# EAGLE design sapflow_v5 (EAGLE 9.6.0)
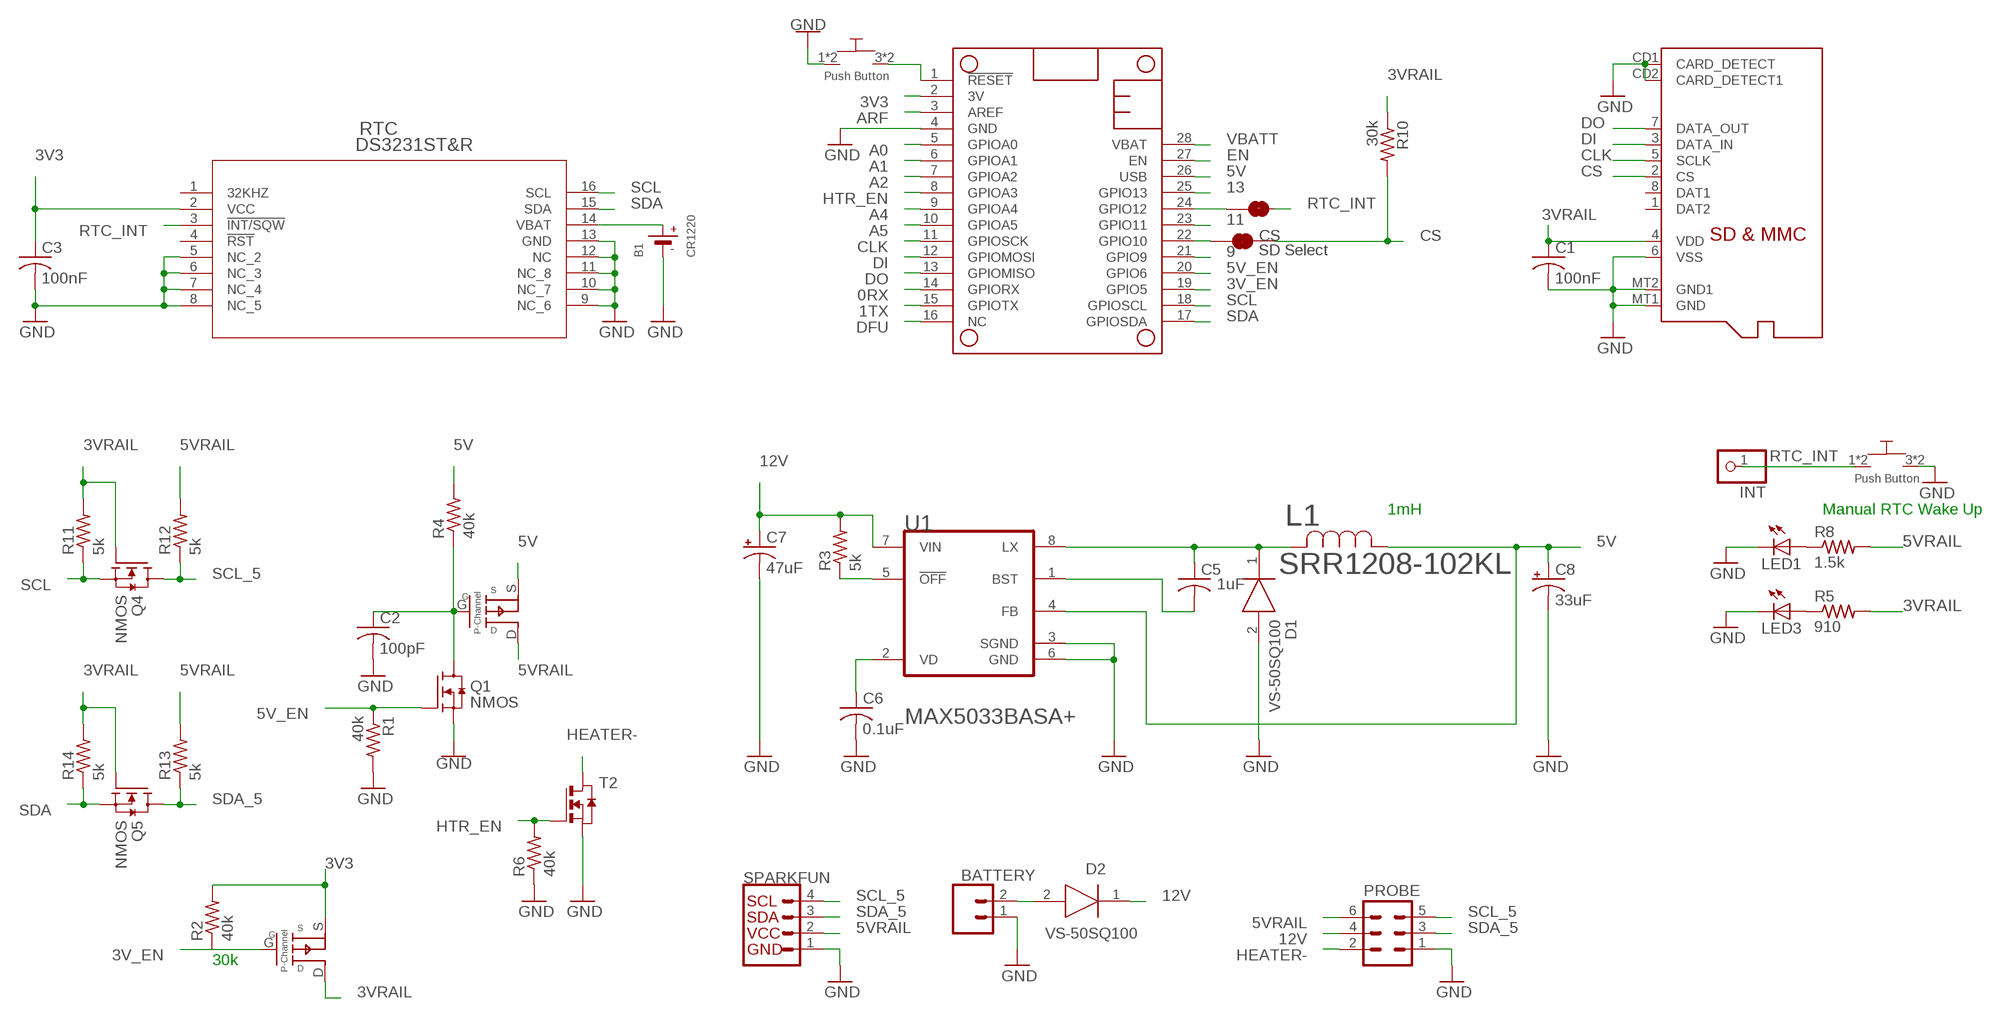
[diagram p0: schematic, sheet 1]

## Parts
B1  CR1220  BATTERYCR1220_SMT  [CR1220]
BATTERY  HIGHV-OUT  CONN_021X02_NO_SILK  [1X02_NO_SILK]
C1  100nF  C-USC0805  [C0805]
C2  100pF  C-USC0805  [C0805]
C3  100nF  C-USC0805  [C0805]
C5  1uF  C-USC0805  [C0805]
C6  0.1uF  C-USC0805  [C0805]
C7  47uF  CPOL-USD/7343-31R  [D/7343-31R]
C8  33uF  CPOL-USD/7343-31R  [D/7343-31R]
CS  SD Select  JUMPER-SMT_2_NC_TRACE_SILK  [SMT-JUMPER_2_NC_TRACE_SILK]
D1  VS-50SQ100  [DIOAD1405W86L465D235]
D2  VS-50SQ100  [DIOAD1405W86L465D235]
INT  PINHD-1X1CB  [1X01-CLEANBIG]
L1  SRR1208-102KL  [IND_BOURNS_SRR1208]
LED1  RED  LEDCHIPLED_0805  [CHIPLED_0805]
LED3  RED  LEDCHIPLED_0805  [CHIPLED_0805]
MICROSD  MICROSD  [MICROSD]
MS2  FEATHERWING  [FEATHERWING]
PMOS1  SSM3J3228R  [SOT-23-3]
PMOS2  SSM3J3228R  [SOT-23-3]
PROBE  MA03-2  [MA03-2]
Q1  NMOS  [SOT23-S]
Q4  NMOS  [SOT23-S]
Q5  NMOS  [SOT23-S]
R1  40k  R-US_R0805  [R0805]
R2  40k  R-US_R0805  [R0805]
R3  5k  R-US_R0805  [R0805]
R4  40k  R-US_R0805  [R0805]
R5  910  R-US_R0805  [R0805]
R6  40k  R-US_R0805  [R0805]
R8  1.5k  R-US_R0805  [R0805]
R10  30k  R-US_R0805  [R0805]
R11  5k  R-US_R0805  [R0805]
R12  5k  R-US_R0805  [R0805]
R13  5k  R-US_R0805  [R0805]
R14  5k  R-US_R0805  [R0805]
RTC  DS3231ST&R  [21-0042B_16]
RTC_INT  JUMPER-SMT_2_NC_TRACE_SILK  [SMT-JUMPER_2_NC_TRACE_SILK]
SPARKFUN  I2C_STANDARD_NO_SILK  [1X04_NO_SILK]
T2  NMOSSOT223  [SOT223]
U1  MAXIM_MAX5033BASA+MAXIM_MAX5033BASA+_0_1  [MAXIM_MAX5033BASA+_1]
U$1  PUSH_BUTTON  [PUSHBUTTON_SMD]
U$2  PUSH_BUTTON  [PUSHBUTTON_SMD]

## Nets
0RX: MS2.14(GPIORX)
1TX: MS2.15(GPIOTX)
3V3: C3.1 MS2.2(3V) PMOS2.S R2.2 RTC.2(VCC)
3V_EN: MS2.19(GPIO5) PMOS2.G R2.1
3VRAIL: C1.1 MICROSD.4(VDD) PMOS2.D Q4.1(G) Q5.1(G) R5.2 R10.1 R11.2 R14.2
5V: C8.+ L1.1 MS2.26(USB) PMOS1.S R4.2 U1.4(FB)
5V_EN: MS2.20(GPIO6) Q1.1(G) R1.1
5VRAIL: PMOS1.D PROBE.6 R8.2 R12.2 R13.2 SPARKFUN.2(VCC)
9: MS2.21(GPIO9)
11: MS2.23(GPIO11)
12V: C7.+ D2.1(K) PROBE.4 R3.2 U1.7(VIN)
13: MS2.25(GPIO13)
A0: MS2.5(GPIOA0)
A1: MS2.6(GPIOA1)
A2: MS2.7(GPIOA2)
A4: MS2.9(GPIOA4)
A5: MS2.10(GPIOA5)
ARF: MS2.3(AREF)
CLK: MICROSD.5(SCLK) MS2.11(GPIOSCK)
CS: CS.2 MICROSD.2(CS) R10.2
DFU: MS2.16(NC)
DI: MICROSD.3(DATA_IN) MS2.12(GPIOMOSI)
DO: MICROSD.7(DATA_OUT) MS2.13(GPIOMISO)
EN: MS2.27(EN)
GND [GND]: B1.- BATTERY.1 C1.2 C2.2 C3.2 C6.2 C7.- C8.- D1.2(A) LED1.C LED3.C MICROSD.6(VSS) MICROSD.CD1(CARD_DETECT) MICROSD.CD2(CARD_DETECT1) MICROSD.MT1(GND) MICROSD.MT2(GND1) MS2.4(GND) PROBE.1 Q1.2(S) R1.2 R6.1 RTC.5(NC_2) RTC.6(NC_3) RTC.7(NC_4) RTC.8(NC_5) RTC.9(NC_6) RTC.10(NC_7) RTC.11(NC_8) RTC.12(NC) RTC.13(GND) SPARKFUN.1(GND) T2.3(S) U1.3(SGND) U1.6(GND) U$1.1 U$1.2 U$2.3 U$2.4
HEATER-: PROBE.2 T2.2(D) T2.4(D)
HTR_EN: MS2.8(GPIOA3) R6.2 T2.1(G)
N$1: MS2.1(!RESET) U$1.3 U$1.4
N$2: B1.+$1(+) RTC.14(VBAT)
N$4: BATTERY.2 D2.2(A)
N$5: LED3.A R5.1
N$6: C6.1 U1.2(VD)
N$9: R3.1 U1.5(!OFF!)
N$10: C2.1 PMOS1.G Q1.3(D) R4.1
N$11: CS.1 MS2.22(GPIO10)
N$12: LED1.A R8.1
N$14: MS2.24(GPIO12) RTC_INT.1
N$16: C5.2 U1.1(BST)
N$17: C5.1 D1.1(K) L1.2 U1.8(LX)
RTC_INT: INT.1 RTC.3(!INT/SQW) RTC_INT.2 U$2.1 U$2.2
SCL: MS2.18(GPIOSCL) Q4.2(S) R11.1 RTC.16(SCL)
SCL_5: PROBE.5 Q4.3(D) R12.1 SPARKFUN.4(SCL)
SDA: MS2.17(GPIOSDA) Q5.2(S) R14.1 RTC.15(SDA)
SDA_5: PROBE.3 Q5.3(D) R13.1 SPARKFUN.3(SDA)
VBATT: MS2.28(VBAT)
Unconnected: MICROSD.1(DAT2) MICROSD.8(DAT1) RTC.1(32KHZ) RTC.4(!RST)

## Notes on the sheet
- 1mH | Manual RTC Wake Up
- 30k

## Library data of the parts
B1 = microbuilder:BATTERY: CR1220 SMT - Digikey: 3001K-ND CD2032 BAT-HLD-001 - Digikey: BAT-HLD-001-ND
BATTERY = SparkFun-Connectors:CONN_02: Multi connection point. Often used as Generic Header-pin footprint for 0.1 inch spaced/style header connections On any of the 0.1 inch spaced packages, you can populate with these: Break Away Headers - Straight <https://www.sparkfun.com/products/116> (PRT-00116) Break Away Male Headers - Right Angle <https://www.sparkfun.com/products/553> (PRT-00553) Female Headers <https://www.sparkfun.com/products/115> (PRT-00115) Break Away Headers - Machine Pin <https://www.sparkfun.com/products/117> (PRT-00117) Break Away Female Headers - Swiss Machine Pin <https://www.sparkfun.com/products/743> (PRT-00743) For SCREWTERMINALS and SPRING TERMINALS visit here: Screw Terimnals on SparkFun.com <https://www.sparkfun.com/search/results?term=Screw+Terminals> (5mm/3.5mm/2.54mm spacing) This device is also useful as a general connection point to wire up your design to another part of your project. Our various solder wires solder well into these plated through hole pads. Hook-Up Wire - Assortment (Stranded, 22 AWG) <https://www.sparkfun.com/products/11375> (PRT-11375) Hook-Up Wire - Assortment (Solid Core, 22 AWG) <https://www.sparkfun.com/products/11367> (PRT-11367) View the entire wire category on our website here <https://www.sparkfun.com/categories/141> Special notes: Molex polarized connector foot print use with: PRT-08233 with associated crimp pins and housings. 2.54_SCREWTERM for use with PRT-10571. 3.5mm Screw Terminal footprints for PRT-08084 5mm Screw Terminal footprints for use with PRT-08432
C1 C3 = adafruit:C-US: CAPACITOR, American symbol
C2 = resistor:C-US: CAPACITOR, American symbol
C5 C6 = rcl:C-US: CAPACITOR, American symbol; SPICEPREFIX: C
C7 C8 = rcl:CPOL-US: POLARIZED CAPACITOR, American symbol; SPICEPREFIX: C
CS RTC_INT = SparkFun-Jumpers:JUMPER-SMT_2_NC_TRACE: Normally closed trace jumper This jumper has a trace between two pads so it's normally closed (NC). Use a razor knife to open the connection. For best results follow the IPC guidelines for cutting traces: Cutout at least 0.063 mm (0.005 in). Remove all loose material to clean up the cut area. Seal the cut with an approved epoxy. Reapply solder to reclose the connection.
D1 D2 = VS-50SQ100:VS-50SQ100: VS-50SQ100, Schottky Diode, 5A max, 100V, 2-Pin, DO-204AR Source: Datasheet <http://docs-emea.rs-online.com/webdocs/0791/0900766b8079106c.pdf>; ALLIED_NUMBER: 70078786; ALLIED_PRICE-STOCK: http://www.alliedelec.com/vishay-pcs-vs-50sq100/70078786/; DESCRIPTION: VS-50SQ100, Schottky Diode, 5A max, 100V, 2-Pin, DO-204AR; HEIGHT: mm; MANUFACTURER_NAME: Vishay; MANUFACTURER_PART_NUMBER: VS-50SQ100; MOUSER_PART_NUMBER: 844-50SQ100; MOUSER_PRICE-STOCK: https://www.mouser.com/Search/Refine.aspx?Keyword=844-50SQ100; RS_PART_NUMBER: 5446041; RS_PRICE-STOCK: https://uk.rs-online.com/web/p/products/5446041
INT = adafruit:PINHD-1X1: Pin header 1x1 for 0.1" spacing With round pins
L1 = SRR1208-102KL:SRR1208-102KL; BUILT_BY: EMA_UL_Team; MANUFACTURER_PART_NUMBER: SRR1208-102KL; VENDOR: Bourns Electronics
LED1 LED3 = adafruit:LED: LED OSRAM: - CHIPLED LG R971, LG N971, LY N971, LG Q971, LY Q971, LO R971, LY R971 LH N974, LH R974 LS Q976, LO Q976, LY Q976 LO Q996 - Hyper CHIPLED LW Q18S LB Q993, LB Q99A, LB R99A - SideLED LS A670, LO A670, LY A670, LG A670, LP A670 LB A673, LV A673, LT A673, LW A673 LH A674 LY A675 LS A676, LA A676, LO A676, LY A676, LW A676 LS A679, LY A679, LG A679 - Hyper Micro SIDELED® LS Y876, LA Y876, LO Y876, LY Y876 LT Y87S - SmartLED LW L88C, LW L88S LB L89C, LB L89S, LG L890 LS L89K, LO L89K, LY L89K LS L896, LA L896, LO L896, LY L896 - TOPLED LS T670, LO T670, LY T670, LG T670, LP T670 LSG T670, LSP T670, LSY T670, LOP T670, LYG T670 LG T671, LOG T671, LSG T671 LB T673, LV T673, LT T673, LW T673 LH T674 LS T676, LA T676, LO T676, LY T676, LB T676, LH T676, LSB T676, LW T676 LB T67C, LV T67C, LT T67C, LS T67K, LO T67K, LY T67K, LW E67C LS E67B, LA E67B, LO E67B, LY E67B, LB E67C, LV E67C, LT E67C LW T67C LS T679, LY T679, LG T679 LS T770, LO T770, LY T770, LG T770, LP T770 LB T773, LV T773, LT T773, LW T773 LH T774 LS E675, LA E675, LY E675, LS T675 LS T776, LA T776, LO T776, LY T776, LB T776 LHGB T686 LT T68C, LB T68C - Hyper Mini TOPLED® LB M676 - Mini TOPLED Santana® LG M470 LS M47K, LO M47K, LY M47K Source: http://www.osram.convergy.de/
MICROSD = adafruit_improved:MICROSD: Micro-SD / Transflash card holder with SPI pinout For the 3M # 2908-05WB-MG and/or 4UCON #19656 push-push type
MS2 = adafruit:FEATHERWING
PMOS1 PMOS2 = M0_Power:SSM3J3228R: P-Channel MOSFET, SOT-23-3 SMD Package
PROBE = better_header:MA03-2: PIN HEADER; OC_FARNELL: unknown; OC_NEWARK: unknown
Q1 Q4 Q5 = eDNA:NMOS
R1-R6 R8 R10-R14 = rcl:R-US_: RESISTOR, American symbol; SPICEPREFIX: R
RTC = power8:DS3231ST&R: DS3231 RTC IC only; MANUFACTURER_PART_NUMBER: DS3231S#T&R; VENDOR: Maxim Integrated Products
SPARKFUN = SparkX:I2C_STANDARD: SparkFun I2C Standard Pinout Header SparkFun has standardized on a pinout for all I2C based sensor breakouts. This pinout allows I2C boards to be plugged directly into the headers on Arduino Uno compatible boards, and to be daisy chained easily. Example SparkFun Products: SparkFun Atmospheric Sensor Breakout - BME280 <https://www.sparkfun.com/products/13676> SparkFun Altitude/Pressure Sensor Breakout - MPL3115A2 <https://www.sparkfun.com/products/11084> SparkFun TOF Range Finder Sensor - VL6180 <https://www.sparkfun.com/products/12785>
T2 = zetex:NMOSSOT223: MOS FET; OC_FARNELL: unknown; OC_NEWARK: unknown
U1 = Maxim - MAX5033BASA+:MAXIM_MAX5033BASA+: MAX-MAX5033-IL8; CIIVA_IDS: 1484514; CODE__IPC: SOIC127P600-8; CODE__JEDEC: MS-012-AA; COMPONENT_LINK_1_DESCRIPTION: Manufacturer URL; COMPONENT_LINK_1_URL: http://www.maxim-ic.com; COMPONENT_LINK_3_DESCRIPTION: Package Specification; COMPONENT_LINK_3_URL: http://pdfserv.maxim-ic.com/package_dwgs/21-0041.PDF; DATASHEET: http://datasheets.maxim-ic.com/en/ds/MAX5033.pdf; DATASHEET_VERSION: Rev 5, May-2011; FOOTPRINT_VARIANT_NAME_0: Level C; FOOTPRINT_VARIANT_NAME_1: Level B; FOOTPRINT_VARIANT_NAME_2: Level A; IMPORTED: yes; IMPORTED_FROM: vault; IMPORT_TS: 1521862065; MF: Maxim; MPN: MAX5033BASA+; PACKAGE: S8+5; PACKAGE_DESCRIPTION: 8-Pin Small-Outline IC, Narrow (0.15in), 1.27 mm Pitch, SOIC (N), Pb-Free; PACKAGE_VERSION: revC, 2010; PREFIX: U; RELEASE_DATE: 1332919945; VAULT_GUID: 1E7CABE1-80B5-44B1-A1B1-D79A0DB0D6E1; VAULT_REVISION: 223A1D72-BB07-4F7F-9695-43D469E578B1
U$1 U$2 = eDNA:PUSH_BUTTON: SMD low profile push-button NOPE https://www.mouser.com/ProductDetail/ALPS/SKTHAHE010?qs=sGAEpiMZZMsgGjVA3toVBFPD9IcV2kPoEtmOqlcDILk%3D https://www.digikey.com/product-detail/en/c-k/KMR731NG-LFS/CKN10687TR-ND/6035353 https://www.arrow.com/en/products/kmr731nglfs/ck https://www.mouser.com/ProductDetail/CK/KMR731NGLFS?qs=%2Fha2pyFaduiYmAh2YH01EjoHSsd%2F4x%252BsVgk0GVi4JwmLxfMBh2nzdw%3D%3D

## Net classes
0 default: clearance 0.205 mm
1 GND: clearance 0.205 mm to class 0, clearance 0.205 mm
2 HIGHVOLTAGE: clearance 0.205 mm to class 0, clearance 0.205 mm to class 1, clearance 0.3 mm

## Board
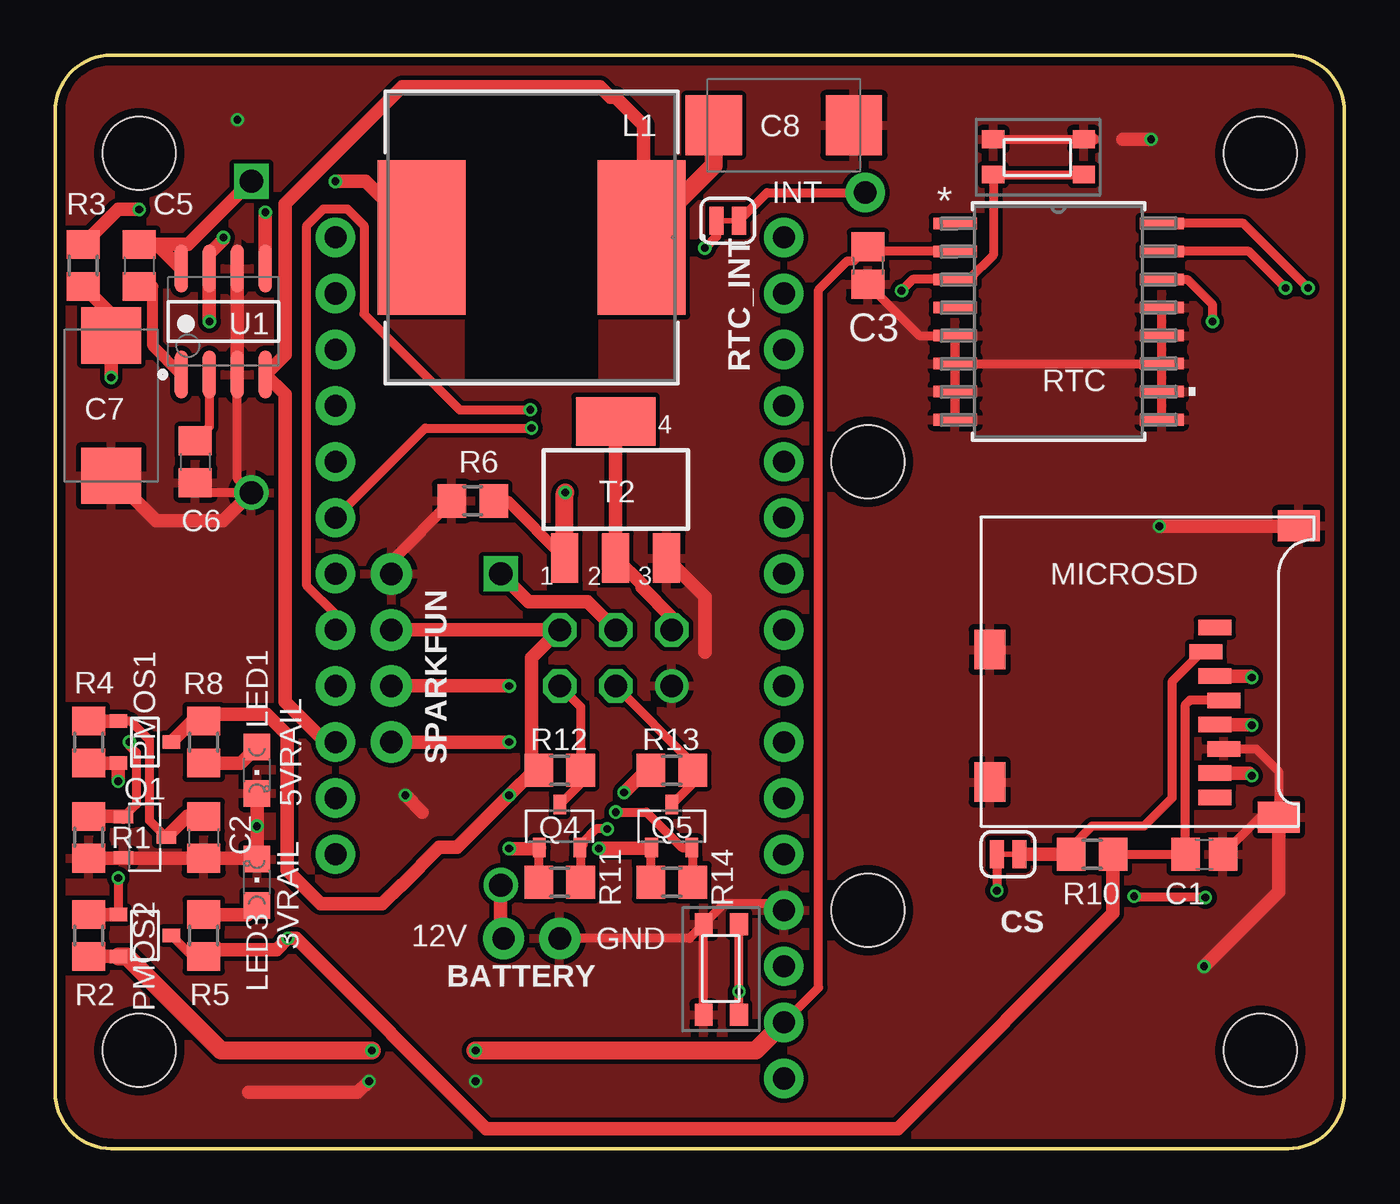
[diagram p1: board, top side]
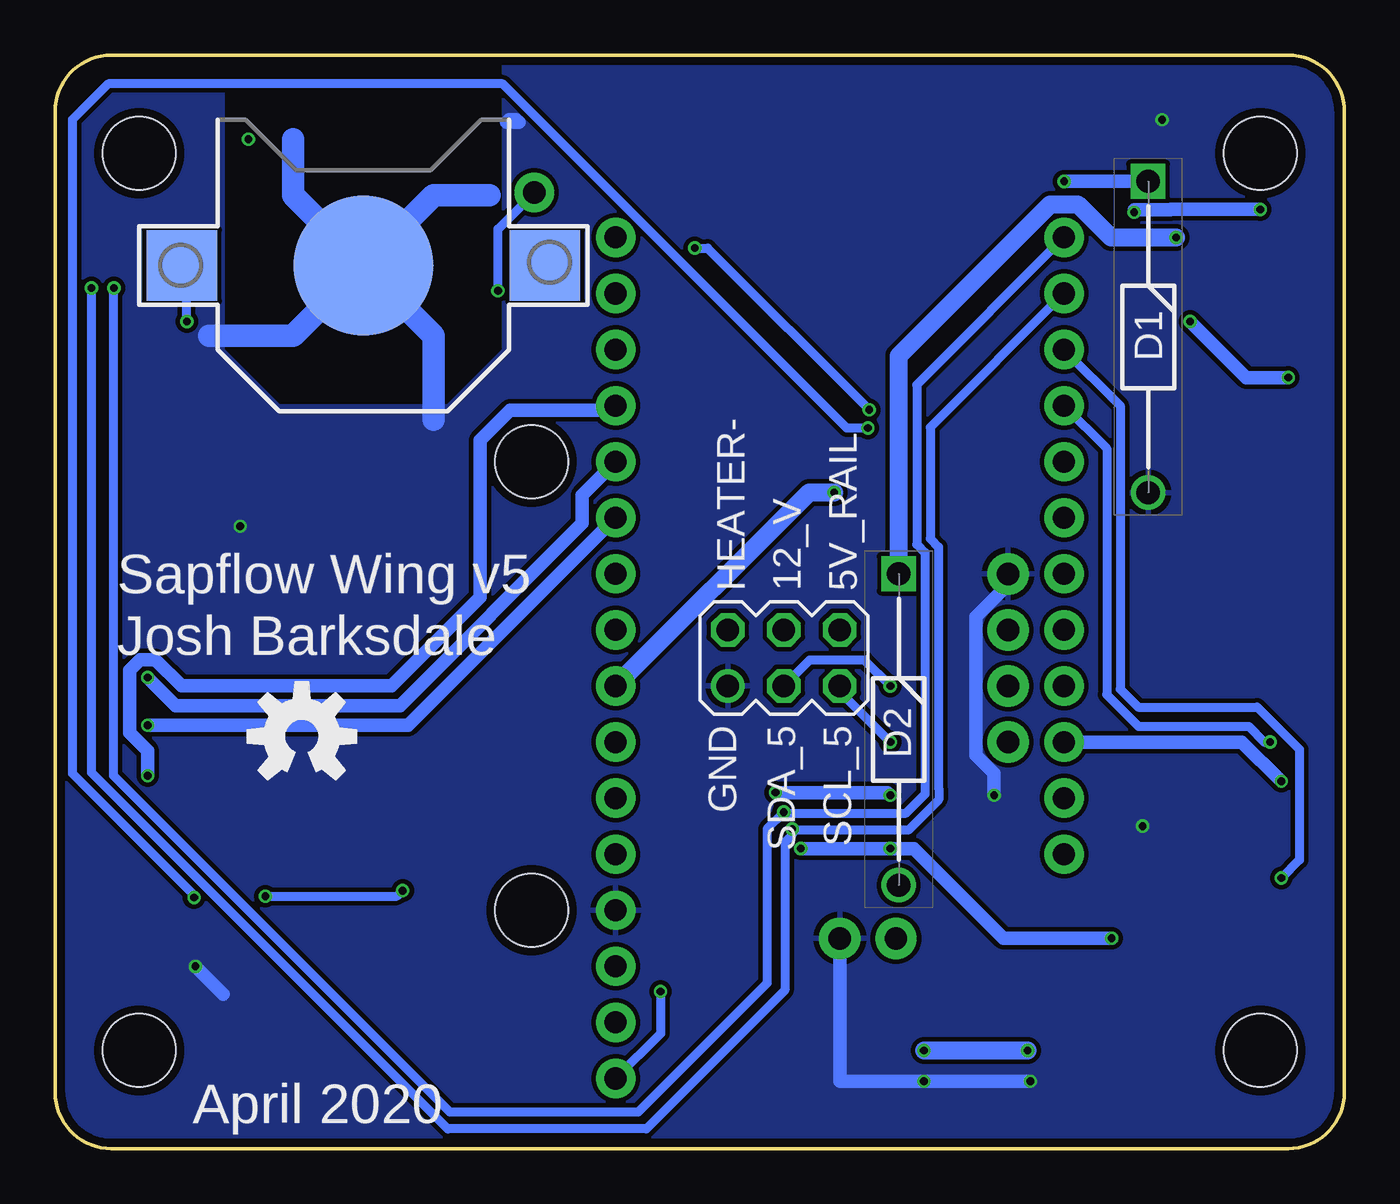
[diagram p2: board, bottom side, seen from below]

Size 58.42 x 49.53 mm. Coordinates in mm from the lower left corner, seen from the top.
Outline: 2.54,49.53 55.88,49.53 arc-90 58.42,46.99 58.42,2.54 arc-90 55.88,0 2.54,0 arc-90 0,2.54 0,46.99 arc-90 2.54,49.53
Copper layers (1*16): Top 0.035559375mm / dielectric 1.6mm / Bottom 0.035559375mm
Design rules "osh_park": minimum track width 6mil, minimum drill 10mil, track to track 6mil, track to pad 6mil, pad to pad 6mil, via to via 6mil, smd to smd 6mil, copper to edge 15mil, drill to drill 6mil, minimum pad ring 5mil, minimum via ring 5mil, stop-mask expansion 2.5mil, vias tented up to drill 0mil, thermal gap 10mil

### Footprints (pad centres in the part's own frame; a part is rotated, then mirrored left to right if it is on the bottom)
CR1220 = smd 3.2 x 3.2: +$1 -8.225,0; +$2 8.225,0 | smd 6.35 x 6.35: - 0,0
1X02_NO_SILK = drill 1.016 pad 1.88: 1 0,0; 2 2.54,0
C0805 = smd 1.3 x 1.5: 1 -0.85,0; 2 0.85,0
C0805' = smd 1.3 x 1.5: 1 -0.95,0; 2 0.95,0
D/7343-31R = smd 2.55 x 2.7: + 3.175,0; - -3.175,0
SMT-JUMPER_2_NC_TRACE_SILK = smd 0.635 x 1.27: 1 -0.508,0; 2 0.508,0
DIOAD1405W86L465D235 = drill 1.05 pad 1.575 square: 1 0,0 | drill 1.05 pad 1.575: 2 14.1,0
STAND-OFF = hole 3.302: 0,0
1X01-CLEANBIG = drill 1.016 pad 1.778: 1 0,0
IND_BOURNS_SRR1208 = smd 3.988 x 7.01: 1 -4.991,0; 2 4.991,0
CHIPLED_0805 = smd 1.2 x 1.2: A 0,-1.05; C 0,1.05
MICROSD = smd 0.7 x 1.5: 1 9,-10.64; 2 7.9,-10.24; 3 6.8,-10.64; 4 5.7,-11.04; 5 4.6,-10.64; 6 3.5,-11.04; 7 2.4,-10.64; 8 1.3,-10.64 | smd 1.8 x 1.4: CD1 2,-0.44; CD2 8,-0.44 | smd 1.4 x 1.9: MT1 0.4,-13.54; MT2 13.6,-14.44
FEATHERWING = drill 1 pad 1.778: 1 6.35,1.27; 2 8.89,1.27; 3 11.43,1.27; 4 13.97,1.27; 5 16.51,1.27; 6 19.05,1.27; 7 21.59,1.27; 8 24.13,1.27; 9 26.67,1.27; 10 29.21,1.27; 11 31.75,1.27; 12 34.29,1.27; 13 36.83,1.27; 14 39.37,1.27; 15 41.91,1.27; 16 44.45,1.27; 17 44.45,21.59; 18 41.91,21.59; 19 39.37,21.59; 20 36.83,21.59; 21 34.29,21.59; 22 31.75,21.59; 23 29.21,21.59; 24 26.67,21.59; 25 24.13,21.59; 26 21.59,21.59; 27 19.05,21.59; 28 16.51,21.59
SOT-23-3 = smd 0.8 x 0.6: D 1.2,0; G -1.2,0.95; S -1.2,-0.95
MA03-2 = drill 1.016: 1 -2.54,-1.27 | drill 1.016 octagon: 2 -2.54,1.27; 3 0,-1.27; 4 0,1.27; 5 2.54,-1.27; 6 2.54,1.27
SOT23-S = smd 0.88 x 0.569: 1 -0.975,0.915; 2 -0.975,-0.915; 3 0.975,0
R0805 = smd 1.3 x 1.5: 1 -0.95,0; 2 0.95,0
21-0042B_16 = smd 1.981 x 0.533: 1 -4.686,4.445; 2 -4.686,3.175; 3 -4.686,1.905; 4 -4.686,0.635; 5 -4.686,-0.635; 6 -4.686,-1.905; 7 -4.686,-3.175; 8 -4.686,-4.445; 9 4.686,-4.445; 10 4.686,-3.175; 11 4.686,-1.905; 12 4.686,-0.635; 13 4.686,0.635; 14 4.686,1.905; 15 4.686,3.175; 16 4.686,4.445
1X04_NO_SILK = drill 1.016 pad 1.88: 1 0,0; 2 2.54,0; 3 5.08,0; 4 7.62,0
SOT223 = smd 1.219 x 2.235: 1 -2.311,-3.099; 2 0,-3.099; 3 2.311,-3.099 | smd 3.6 x 2.2: 4 0,3.099
MAXIM_MAX5033BASA+_1 = smd 2.2 x 0.6: 1 -2.4,1.905; 2 -2.4,0.635; 3 -2.4,-0.635; 4 -2.4,-1.905; 5 2.4,-1.905; 6 2.4,-0.635; 7 2.4,0.635; 8 2.4,1.905
PUSHBUTTON_SMD = smd 1 x 0.8: 1 0,-1.6; 2 4.1,-1.6; 3 0,0; 4 4.1,0

### Placement (x,y rotation side)
B1  44.45,40.01 0 bottom
BATTERY  22.86,9.53 180 top
C1  52.07,13.34 0 top
C2  100pF  [C0805']  6.73,14.1 270 top
C3  36.83,40.01 270 top
C5  1uF  [C0805']  3.81,40.01 270 top
C6  0.1uF  [C0805']  6.35,31.11 270 top
C7  2.54,33.66 90 top
C8  33.02,46.36 180 top
CS  43.18,13.34 0 top
D1  8.89,43.82 270 bottom
D2  20.19,26.04 270 bottom
H2  STAND-OFF  [STAND-OFF]  36.83,31.11 0 top
H4  STAND-OFF  [STAND-OFF]  36.83,10.79 0 top
H5  STAND-OFF  [STAND-OFF]  3.81,4.44 180 top
H6  STAND-OFF  [STAND-OFF]  3.81,45.09 180 top
H7  STAND-OFF  [STAND-OFF]  54.61,4.44 180 top
H8  STAND-OFF  [STAND-OFF]  54.61,45.09 180 top
INT  36.7,43.31 0 top
L1  21.59,41.28 180 top
LED1  9.14,17.14 180 top
LED3  9.14,12.07 0 top
LOGO1  OSHW-LOGOM  [OSHW-LOGO-M]  47.24,18.67 0 bottom
MICROSD  41.91,14.61 90 top
MS2  34.29,-3.17 90 top
PMOS1  4.06,18.41 0 top
PMOS2  4.06,9.65 0 top
PROBE  25.4,22.22 0 bottom
Q1  4.06,14.1 0 top
Q4  22.86,14.61 90 top
Q5  27.94,14.61 90 top
R1  1.52,14.1 270 top
R2  1.52,9.65 270 top
R3  1.27,40.01 270 top
R4  1.52,18.41 270 top
R5  6.73,9.65 270 top
R6  18.92,29.34 0 top
R8  6.73,18.41 90 top
R10  46.99,13.34 180 top
R11  22.86,12.07 180 top
R12  22.86,17.14 180 top
R13  27.94,17.14 180 top
R14  27.94,12.07 180 top
RTC  45.47,37.47 0 top
RTC_INT  30.48,42.04 0 top
SPARKFUN  15.24,26.04 270 top
T2  25.4,29.84 0 top
U1  7.62,37.47 90 top
U$1  30.99,10.16 270 top
U$2  42.51,45.72 0 top

### Tracks (layer width: path | path; a pad name or v marks a point on that pad's centre or on a via)
3V3  (via drill 0.35)
  Top 0.406: RTC.2 37.05,40.64 C3.1 36.19,40.21 35.91,40.21 34.59,38.9 34.59,7.29 MS2.2
  Top 0.61: R2.2 PMOS2.S
  Top 0.813: PMOS2.S 3.25,8.7 7.5,4.44 v14.35,4.44 | v19.05,4.44 31.75,4.44 MS2.2
  Bottom 0.813: v19.05,4.44 v14.35,4.44
3V_EN  (via drill 0.35)
  Top 0.406: v2.86,12.26 v2.86,12.25 PMOS2.G
  Top 0.61: R2.1 PMOS2.G
  Bottom 0.406: MS2.19 10.16,33.65 10.16,20.82 9.34,20 3.95,20 2.03,18.09 2.03,13.08 v2.86,12.26
3VRAIL  (via drill 0.35)
  Top 0.406: Q5.1 26.99,13.6 R14.2 | Q4.1 21.91,13.6 R11.2 | MICROSD.4 51.45,20.3 51.44,20.32 51.22,20.11 C1.1 R10.1 | PMOS2.D 6.21,8.7 R5.2
  Top 0.61: R5.2 7.05,9.02 10.03,9.02 v10.54,9.53 10.91,9.53 19.54,0.9 38.18,0.9 47.94,10.66 R10.1 | Q4.1 21.9,13.59 v20.57,13.59 | v24.64,13.59 v24.64,13.6 26.99,13.6
  Bottom 0.61: v10.54,9.53 15.44,9.53 19.5,13.59 v20.57,13.59 v24.64,13.59
5V  (via drill 0.35)
  Top 0.61: R4.2 PMOS1.S v2.86,16.64 | MS2.26 12.25,18.41 10.41,20.25 10.41,34.18 U1.4 10.41,35.95 10.41,42.8 15.72,48.11 24.69,48.11 25.18,47.62 25.4,47.62 26.67,46.36 26.67,41.36 26.63,41.32
  Top 0.813: L1.1 26.63,41.32 29.85,44.54 C8.+
  Bottom 0.61: v2.86,16.64 4.64,18.41 MS2.26
5V_EN  (via drill 0.35)
  Top 0.406: v3.37,18.41 3.37,18.24 3.67,17.93 3.67,15.6 Q1.1
  Top 0.61: R1.1 3.05,15.05 Q1.1
  Bottom 0.406: MS2.20 10.77,31.72 10.77,20.56 9.33,19.13 4.34,19.13 3.63,18.41 v3.37,18.41
5VRAIL  (via drill 0.35)
  Top 0.61: PMOS1.D 6.21,19.36 R8.2 7.05,19.68 9.58,19.68 10.51,18.75 10.51,12.61 12.03,11.08 14.83,11.08 15.68,11.94 15.69,11.94 17.41,13.65 18.22,13.65 v20.57,16 21.72,17.14 R12.2 21.59,17.46 21.59,20.43 21.59,22.22 PROBE.6 SPARKFUN.2 | R13.2 26.8,17.14 v25.78,16.13
  Bottom 0.61: v25.78,16.13 20.7,16.13 v20.57,16
12V  (via drill 0.35)
  Top 0.61: v6.98,37.47 U1.7 6.98,40.54 7.62,41.18 v7.62,41.28 | v2.54,34.93 C7.+ 2.54,37.79 R3.2 | PROBE.4 24.13,24.77 22.33,24.77 21.46,24.77 D2.1
  Bottom 0.61: v6.98,37.47 4.45,34.93 v2.54,34.93
  Bottom 0.813: D2.1 20.19,35.9 13.32,42.78 12.08,42.78 10.58,41.28 v7.62,41.28
CLK  (via drill 0.35)
  Top 0.61: MICROSD.5 54.2,19.2 v54.23,19.18
  Bottom 0.61: v54.23,19.18 42.42,19.18 MS2.11
CS
  Top 0.406: MICROSD.2 51.97,22.5 50.61,21.14 50.61,15.88 49.34,14.61 46.99,14.61 46.04,13.66 R10.2
  Top 0.61: CS.2 R10.2
DI  (via drill 0.35)
  Top 0.61: MICROSD.3 54.16,21.4 v54.23,21.34
  Bottom 0.61: v54.23,21.34 52.96,20.07 42.8,20.07 34.54,28.32 34.54,29.59 MS2.12
DO  (via drill 0.35)
  Top 0.61: MICROSD.7 54.12,17 v54.23,16.89
  Bottom 0.61: v54.23,16.89 54.23,18.02 55.04,18.84 55.04,21.67 54.57,22.15 53.89,22.15 52.7,20.95 43.18,20.95 39.17,24.97 39.17,32.08 37.8,33.45 33.22,33.45 MS2.13
GND  (via drill 0.35)
  Top 0.406: C3.2 39.16,36.83 RTC.5 RTC.6 | C1.2 54.59,15.01 MICROSD.MT1 55.45,17.07 54.41,18.11 MICROSD.6 | RTC.6 RTC.7 RTC.8 | RTC.6 RTC.11 | RTC.9 RTC.10 RTC.11 | RTC.11 RTC.12 RTC.13 | U$2.3 U$2.4 | U$1.2 U$1.1 | U$1.1 30.34,11.11 32.7,11.11 MS2.4 | U$1.1 28.75,9.53 BATTERY.1 | C6.2 6.8,29.71 D1.2 8.26,30.35 U1.3
  Top 0.508: R6.1 15.24,26.6 SPARKFUN.1
  Top 0.61: U1.6 U1.3 | R1.2 3.05,13.15 Q1.2 3.12,13.15 C2.2 9.11,13.15 LED3.C v9.14,14.61 LED1.C | D1.2 7.62,28.45 4.58,28.45 C7.- | T2.3 29.45,25.01 29.45,22.47 | MICROSD.MT1 55.45,11.63 v52.07,8.26 | v15.88,16 16.64,15.24 | U$2.4 46.99,45.72 | 48.39,45.72 v49.66,45.72 | MICROSD.MT2 56.34,28.19 v50.04,28.19 | v14.22,3.05 13.72,2.54 8.76,2.54
  Bottom 0.61: v52.07,8.26 50.8,6.98 | SPARKFUN.1 15.24,25.54 16.69,24.09 16.69,17.81 15.88,17 v15.88,16 | BATTERY.1 22.86,3.05 v14.22,3.05 | 37.4,46.48 37.97,46.48 | 37.85,46.61 37.53,46.61
  Bottom 1.016: B1.- 41.28,36.83 41.28,33.02 | B1.- 47.62,43.18 47.62,45.72 | B1.- 41.28,43.18 38.73,43.18 | B1.- 47.62,36.83 51.44,36.83
  other vias: 19.05,3.05 8.26,46.61
  pour Top: -0.76,50.16 59.18,50.16 59.18,-0.64 -0.76,-0.64
  pour Bottom: -0.63,50.16 38.1,50.16 38.1,36.2 40.64,33.66 48.26,33.66 50.8,36.2 50.8,50.16 59.05,50.16 59.05,-0.64 -0.63,-0.64
HEATER-
  Top 0.61: T2.4 T2.2 26.59,25.55 26.59,25.42 27.94,24.07 PROBE.2
HTR_EN  (via drill 0.35)
  Top 0.508: T2.1 20.5,29.34 R6.2
  Top 0.813: T2.1 23.09,29.69 v23.11,29.72
  Bottom 0.813: v23.11,29.72 24.26,29.72 MS2.8
N$1  (via drill 0.35)
  Top 0.406: U$1.4 v30.99,7.11 U$1.3
  Bottom 0.406: v30.99,7.11 30.99,5.21 MS2.1
N$2  (via drill 0.35)
  Top 0.406: v52.45,37.47 52.45,38.21 51.3,39.37 RTC.14
  Bottom 0.406: v52.45,37.47 52.45,39.78 B1.+$1
N$4
  Top 0.61: BATTERY.2 20.19,9.65 D2.2
N$5
  Top 0.61: LED3.A 8.73,10.6 R5.1
N$6
  Top 0.406: U1.2 6.98,32.7 C6.1
N$9  (via drill 0.35)
  Top 0.61: R3.1 2.86,42.55 v3.81,42.55 | v9.52,42.42 U1.5
  Bottom 0.61: v3.81,42.55 7.86,42.55 7.89,42.52 9.52,42.52 v9.52,42.42
N$10
  Top 0.406: Q1.3 4.28,14.85 4.28,18.5 3.42,19.36 PMOS1.G
  Top 0.61: R4.1 PMOS1.G | C2.1 5.99,15.05 Q1.3
N$11  (via drill 0.35)
  Top 0.406: v52.12,11.38 48.95,11.38 v48.9,11.43 | MS2.22 16.76,32.64 v21.59,32.64 | CS.1 v42.67,11.68
  Bottom 0.406: v21.59,32.64 22.55,32.64 38.15,48.23 56.01,48.23 57.64,46.61 57.64,17 52.07,11.43 v52.12,11.38 | v48.9,11.43 42.93,11.43 v42.67,11.68
N$12
  Top 0.61: R8.1 8.41,17.46 LED1.A
N$14  (via drill 0.35)
  Top 0.406: MS2.24 12.7,24.2 11.4,25.5 11.4,41.81 12.16,42.57 13.24,42.57 14,41.81 14,37.8 18.33,33.47 v21.53,33.47 | RTC_INT.1 29.97,41.32 v29.44,40.79
  Bottom 0.406: v29.44,40.79 28.85,40.79 v21.53,33.47
N$16
  Top 0.508: U1.1 4.42,36.36 4.42,39.05 C5.2
N$17  (via drill 0.35)
  Top 0.61: U1.8 4.73,40.86 C5.1 6.03,40.96 D1.1 | v12.7,43.82 14.06,43.82 L1.2
  Bottom 0.61: D1.1 v12.7,43.82
RTC_INT  (via drill 0.35)
  Top 0.406: v38.35,38.86 38.86,39.37 RTC.3 41.4,39.37 42.51,40.48 U$2.1 U$2.2 | RTC_INT.2 32.26,43.31 INT.1
  Bottom 0.406: v38.35,38.86 38.35,41.66 INT.1
SCL  (via drill 0.35)
  Top 0.406: R11.1 23.81,13.6 Q4.2 23.93,13.78 23.93,13.88 24.52,14.48 v25.02,14.48 | v56.77,38.99 53.85,41.91 RTC.16
  Bottom 0.406: MS2.18 18.77,32.67 18.77,27.63 18.39,27.24 18.39,16.33 18.38,16.32 18.38,15.81 19.76,14.43 24.97,14.43 v25.02,14.48 25.02,14.22 25.35,13.88 25.35,7.16 31.62,0.89 40.63,0.89 56.77,17.03 v56.77,38.99
SCL_5  (via drill 0.35)
  Top 0.406: Q4.3 23.81,16.53 R12.1 23.81,20 PROBE.5
  Top 0.61: SPARKFUN.4 v20.57,18.41
  Bottom 0.406: v20.57,18.41 22.86,20.7 PROBE.5
SDA  (via drill 0.35)
  Top 0.406: R14.1 28.89,13.6 Q5.2 28.41,13.63 26.8,15.24 v25.4,15.24 | v55.75,38.99 54.1,40.64 RTC.15
  Bottom 0.406: MS2.17 19.38,34.6 19.38,27.37 19,26.99 19,16.08 18.99,16.07 19.86,15.19 25.35,15.19 v25.4,15.24 26.16,14.48 26.16,7.49 32,1.65 40.53,1.65 55.78,16.9 55.78,38.97 v55.75,38.99
SDA_5  (via drill 0.35)
  Top 0.406: Q5.3 28.89,16.53 R13.1 28.89,17.46 PROBE.3
  Top 0.61: SPARKFUN.3 v20.57,20.95
  Bottom 0.406: v20.57,20.95 21.74,22.12 24.23,22.12 PROBE.3

### Text on the board
tNames: 5VRAIL | 12V | 3VRAIL | GND
bNames: 5V_RAIL | 12_V | HEATER- | Sapflow Wing v5 | Josh Barksdale | SCL_5 | SDA_5 | GND | April 2020